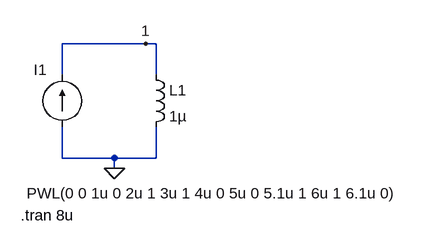
[diagram p0: schematic Fig_6-3_L_di-dt.asc]
Fig_6-3_L_di-dt.asc, the LTspice schematic file:
Version 4
SHEET 1 880 680
WIRE 192 112 64 112
WIRE 208 112 192 112
WIRE 64 160 64 112
WIRE 208 160 208 112
WIRE 64 288 64 240
WIRE 144 288 64 288
WIRE 208 288 208 240
WIRE 208 288 144 288
WIRE 144 304 144 288
FLAG 144 304 0
FLAG 192 112 1
SYMBOL ind 192 144 R0
SYMATTR InstName L1
SYMATTR Value 1µ
SYMBOL current 64 240 R180
WINDOW 0 24 88 Left 2
WINDOW 3 -520 -102 Left 2
WINDOW 123 0 0 Left 2
WINDOW 39 0 0 Left 2
SYMATTR InstName I1
SYMATTR Value PWL(0 0 1u 0 2u 1 3u 1 4u 0 5u 0 5.1u 1 6u 1 6.1u 0)
TEXT 0 376 Left 2 !.tran 8u

The netlist it stands for:
* Fig_6-3_L_di-dt.asc
L1 1 0 1µ
I1 0 1 PWL(0 0 1u 0 2u 1 3u 1 4u 0 5u 0 5.1u 1 6u 1 6.1u 0)
.tran 8u
.backanno
.end